# EAGLE schematic untitled (EAGLE 7.2.0)
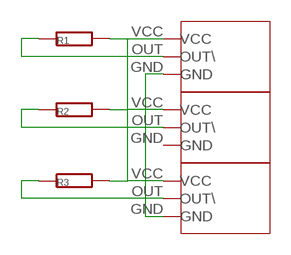
[diagram p0: schematic, sheet 1]

## Parts
R1  R0603  [0603]
R2  R0603  [0603]
R3  R0603  [0603]
U$1  HALL  [HALL]
U$2  HALL  [HALL]
U$3  HALL  [HALL]

## Nets
N$1: U$1.GND U$3.GND
N$2: R1.2 R2.2 R3.2 U$1.VCC U$2.VCC U$3.VCC
N$3: R1.1 U$1.OUT(OUT\)
N$4: R2.1 U$2.OUT(OUT\)
N$5: R3.1 U$3.OUT(OUT\)
Unconnected: U$2.GND

## Library data of the parts
R1-R3 = CasaLibrary:R
U$1-U$3 = CasaLibrary:HALL